# Altium schematic sheet Voeding.SchDoc: Soldeerstation
size A4; DrawnBy: Miguel Nunez; DocumentNumber: 2022/001; Revision: v1; SheetNumber: 4; SheetTotal: 6
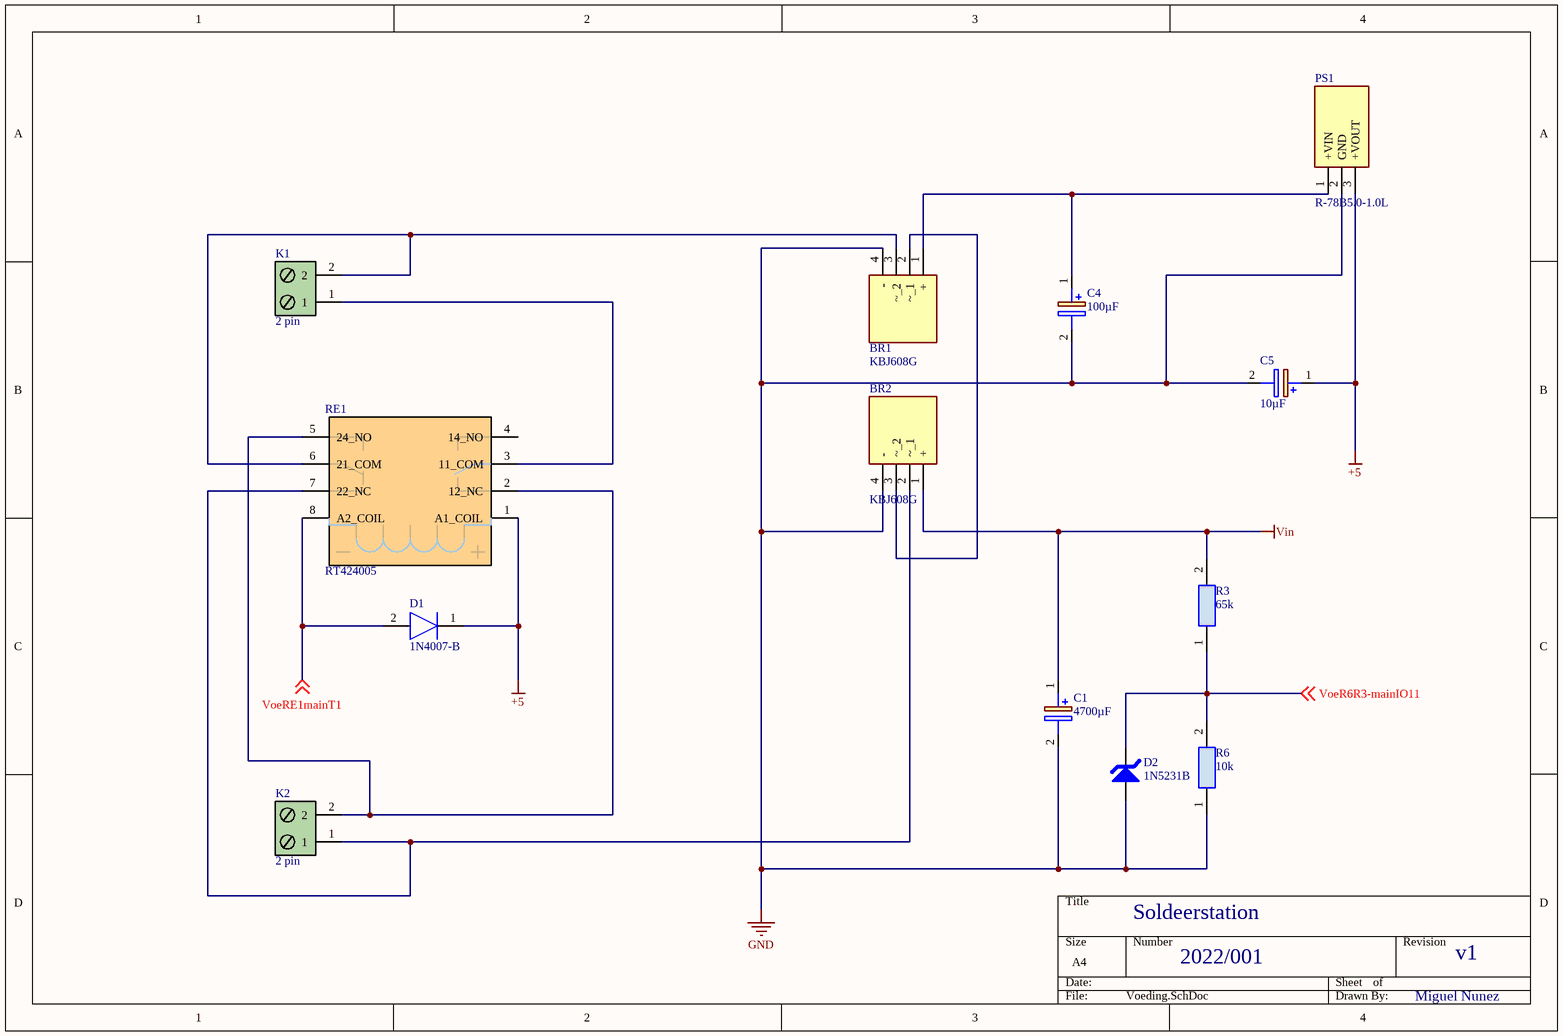
[diagram p0: Voeding.SchDoc]

## Parts
BR1  KBJ608G  [TO750P480X2500X1900-4P]
BR2  KBJ608G  [TO750P480X2500X1900-4P]
C1  4700µF  [WCAP-ATG8_D22H41]
C4  100µF  [WCAP-AT1H_D10H16]
C5  10µF  [WCAP-AT1H_D5H11]
D1  1N4007-B  [DIOAD1410W90L470D235]
D2  1N5231B  [DIOAD1165W56L425D185]
K1  2 pin  [1729128]
K2  2 pin  [1729128]
PS1  R-78B5.0-1.0L  [R78B1210L]
R3  65k  [RESC2012X60N]
R6  10k  [RESC2012X60N]
RE1  RT424005  [RT42]

## Nets
+5: C5.1(+) D1.1(K) PS1.3(+VOUT) RE1.1(A1_COIL)
GND: BR1.4(-) BR2.4(-) C1.2(-) C4.2(-) C5.2(-) D2.2 PS1.2(GND) R6.1
Vin: BR2.1(+) C1.1(+) R3.2
VoeR6R3-mainIO11: D2.1 R3.1 R6.2 ; off-sheet VoeR6R3-mainIO11
VoeRE1mainT1: D1.2(A) RE1.8(A2_COIL) ; off-sheet VoeRE1mainT1
NetBR1_1: BR1.1(+) C4.1(+) PS1.1(+VIN)
NetBR1_2: BR1.2(~_1) BR2.3(~_2)
NetBR1_3: BR1.3(~_2) K1.2 RE1.6(21_COM)
NetBR2_2: BR2.2(~_1) K2.1 RE1.7(22_NC)
NetK1_1: K1.1 RE1.3(11_COM)
NetK2_2: K2.2 RE1.2(12_NC) RE1.5(24_NO)

Not connected (* = marked no-connect by the designer): RE1 4(14_NO)

## Library data of the parts
BR1 BR2 = KBJ608G: Bridge Rectifier; Manufacturer_Name: Diodes Inc.; Datasheet Link: https://componentsearchengine.com//KBJ608G.pdf; Height: 4.8mm; Mouser2 Part Number: 621-KBJ608G; Mouser2 Price/Stock: https://www.mouser.com/Search/Refine.aspx?Keyword=621-KBJ608G; Manufacturer_Part_Number: KBJ608G
C1 = ELCAP 4700µF: Capacitor Polarised ESK478M050AQ3AA; Manufacturer_Name: Kemet; Datasheet Link: https://componentsearchengine.com//ESK478M050AQ3AA.pdf; Height: 37mm; Mouser2 Part Number: 80-ESK478M050AQ3AA; Mouser2 Price/Stock: https://www.mouser.com/Search/Refine.aspx?Keyword=80-ESK478M050AQ3AA; Manufacturer_Part_Number: ESK478M050AQ3AA
C4 = ELCAP 100µF: Capacitor Polarised 100µF Wurth 860241181006; Manufacturer_Name: Wurth Elektronik; Datasheet Link: https://www.we-online.de/katalog/datasheet/860241181006.pdf; Height: 27mm; Manufacturer_Part_Number: 860241181006
C5 = ELCAP 10µF: Capacitor Polarised Wurth Elektronik 860240672002 10µF; Datasheet Link: https://katalog.we-online.de/pbs/datasheet/860240672002.pdf; Height: 12.5mm; Manufacturer_Name: Wurth Elektronik; Manufacturer_Part_Number: 860240672002
D1 = D 1N4007-B: Diode 1N4007-B 1000V, 1A; Manufacturer_Name: Rectron; Datasheet Link: https://www.arrow.com/en/products/1n4007-b/rectron; Manufacturer_Part_Number: 1N4007-B
D2 = ZD 1N5231B: Zenerdiode 1N5231B 5.1V 500mW; Mfr_Name: onsemi; Type: DEV; Copyright: Copyright (C) 2022 Ultra Librarian. All rights reserved.; Manufacturer_Part_Number: 1N5231B; RefDes: RefDes
K1 K2 = Term. blok 2 pin: Connector Term. blok. 1729128 2 pin; Manufacturer_Name: Phoenix Contact; Datasheet Link: http://www.phoenixcontact.com/de/produkte/1729128/pdf; Height: 10.15mm; Manufacturer_Part_Number: 1729128
PS1 = R-78B5.0-1.0L: Power Supply DC/DC converter 6.5-34Vin 5Vout; Manufacturer_Name: RECOM Power; Datasheet Link: https://componentsearchengine.com//R-78B5.0-1.0L.pdf; Height: 9mm; Mouser2 Part Number: 919-R-78B5.0-1.0L; Mouser2 Price/Stock: https://www.mouser.com/Search/Refine.aspx?Keyword=919-R-78B5.0-1.0L; Manufacturer_Part_Number: R-78B5.0-1.0L
R3 = RES 68k 0805: Res Thin Film 0805 68K Ohm 0.1% 1/8W ±25ppm/°C Molded SMD SMD Punched Carrier T/R; Manufacturer: Panasonic; Manufacturer Part Number: ERA-6AEB683V; Resistance: 68kR; Power Rating: 125mW; Voltage Rating: 100V; Supplier 1: RSComponents; RoHS: Yes; Category: Chip SMD Resistors; Stock 1: 790; Pricing 1: 5=0,49000, 50=0,45500, 100=0,42500, 250=0,39500, 500=0,36300 (USD); Mount: Surface Mount; Case/Package: 0805; Number of Pins: 2; Contact Plating: Tin; Case Code (Metric): 2012; Case Code (Imperial): 0805; Min Operating Temperature: -55°C; Max Operating Temperature: 155°C; Tolerance: 0.1%; Resistor Type: Thin Film; Temperature Coefficient: 25ppm/°C; Packaging: Tape and Reel; Package Quantity: 5000; Number of Terminations: 2; Termination: SMD/SMT; Max Power Dissipation: 125mW; Voltage Rating (DC): 100V; Series: ERA-6A; Resistance Tolerance: 0.1%; Technology: METAL FILM; Construction: Rectangular; Length: 2mm; Width: 1.25mm; Height: 0.5mm; Depth: 1.25mm; Radiation Hardening: No; REACH SVHC: No SVHC; Military Standard: Not; Lead Free: Lead Free; ComponentLink1URL: https://datasheet.ciiva.com/11812/0900766b80beefcc-11812834.pdf?src-supplier=RSComponents; ComponentLink1Description: https://datasheet.ciiva.com/11812/0900766b80beefcc-11812834.pdf?src-supplier=RSComponents; ComponentLink2URL: https://datasheet.ciiva.com/26335/453596-da-01-en-widerstand-0805-era-26335721.pdf?src-supplier=Conrad; ComponentLink2Description: https://datasheet.ciiva.com/26335/453596-da-01-en-widerstand-0805-era-26335721.pdf?src-supplier=Conrad; ComponentLink3URL: https://datasheet.ciiva.com/7886/485442-7886653.pdf?src-supplier=Element14; ComponentLink3Description: https://datasheet.ciiva.com/7886/485442-7886653.pdf?src-supplier=Element14; ComponentLink4URL: https://datasheet.ciiva.com/48530/era-eng-tds-48530013.pdf?src-supplier=Distrelec; ComponentLink4Description: https://datasheet.ciiva.com/48530/era-eng-tds-48530013.pdf?src-supplier=Distrelec; ComponentLink5URL: https://datasheet.ciiva.com/48425/era-eng-tds-48425626.pdf?src-supplier=Distrelec; ComponentLink5Description: https://datasheet.ciiva.com/48425/era-eng-tds-48425626.pdf?src-supplier=Distrelec; ComponentLink6URL: https://datasheet.ciiva.com/6138/485442-6138605.pdf?src-supplier=Farnell; ComponentLink6Description: https://datasheet.ciiva.com/6138/485442-6138605.pdf?src-supplier=Farnell; ComponentLink7URL: https://datasheet.ciiva.com/7886/485442-7886654.pdf?src-supplier=Element14; ComponentLink7Description: https://datasheet.ciiva.com/7886/485442-7886654.pdf?src-supplier=Element14; ComponentLink8URL: https://datasheet.ciiva.com/9188/aoa0000ce26-9188075.pdf?src-supplier=Avnet; ComponentLink8Description: https://datasheet.ciiva.com/9188/aoa0000ce26-9188075.pdf?src-supplier=Avnet; ComponentLink9URL: https://datasheet.ciiva.com/30076/54aoa0000ce26-30076872.pdf?src-supplier=Onlinecomponents.com; ComponentLink9Description: https://datasheet.ciiva.com/30076/54aoa0000ce26-30076872.pdf?src-supplier=Onlinecomponents.com; ComponentLink10URL: https://datasheet.ciiva.com/17208/aoa0000ce26-17208888.pdf?src-supplier=Avnet+Europe; ComponentLink10Description: https://datasheet.ciiva.com/17208/aoa0000ce26-17208888.pdf?src-supplier=Avnet+Europe
R6 = RES 10k 0805: 10k SMD 0805  CR0805-FX-1002ELF; Manufacturer_Name: Bourns; Datasheet Link: https://componentsearchengine.com//CR0805-FX-1002ELF.pdf; Height: 0.6mm; Mouser2 Part Number: 652-CR0805FX-1002ELF; Mouser2 Price/Stock: https://www.mouser.com/Search/Refine.aspx?Keyword=652-CR0805FX-1002ELF; Manufacturer_Part_Number: CR0805-FX-1002ELF
RE1 = RT424005: Relay or Contactor; Manufacturer_Name: TE Connectivity; Datasheet Link: https://componentsearchengine.com//RT424005.pdf; Mouser2 Part Number: 655-RT424005; Mouser2 Price/Stock: https://www.mouser.com/Search/Refine.aspx?Keyword=655-RT424005; Manufacturer_Part_Number: RT424005